# Altium project TurboCtrl.PrjPCB
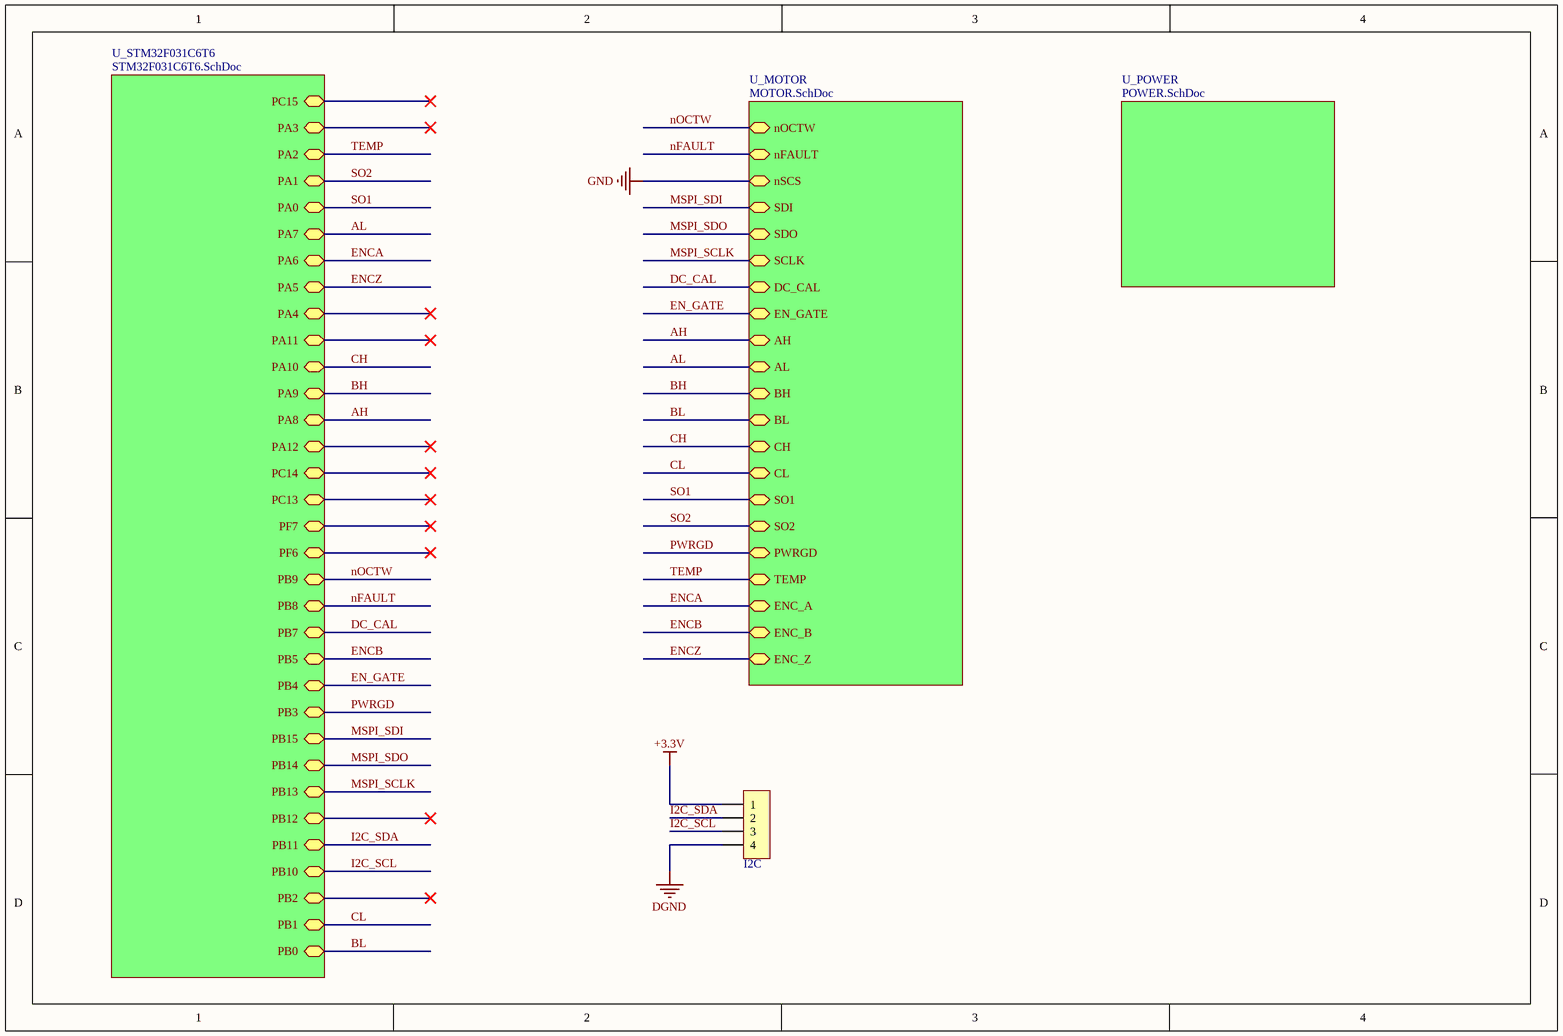
[diagram p0: MAIN.SchDoc]
4 sheets, 107 parts. Net scope: hierarchical (ports join the sheet entries above them; power ports are global).
Board file: TurboCtrl.PcbDoc
Sheets:
  MAIN.SchDoc
    U_MOTOR = MOTOR.SchDoc
    U_STM32F031C6T6 = STM32F031C6T6.SchDoc
    U_POWER = POWER.SchDoc

## Sheet MAIN.SchDoc
size A4

### Parts
I2C  HDR-1X4  [ZH1.5-WS-4P]  (value not drawn)

### Sub-sheets
U_MOTOR = MOTOR.SchDoc: nOCTW (bidir), nFAULT (bidir), nSCS (bidir), SDI (bidir), SDO (bidir), SCLK (bidir), DC_CAL (bidir), EN_GATE (bidir), AH (bidir), AL (bidir), BH (bidir), BL (bidir), CH (bidir), CL (bidir), SO1 (bidir), SO2 (bidir), PWRGD (bidir), TEMP (bidir), ENC_A (bidir), ENC_B (bidir), ENC_Z (bidir)
U_POWER = POWER.SchDoc: no entries
U_STM32F031C6T6 = STM32F031C6T6.SchDoc: PB0 (bidir), PB1 (bidir), PB2 (bidir), PB10 (bidir), PB11 (bidir), PB12 (bidir), PB13 (bidir), PB14 (bidir), PB15 (bidir), PB3 (bidir), PB4 (bidir), PB5 (bidir), PB7 (bidir), PB8 (bidir), PB9 (bidir), PF6 (bidir), PF7 (bidir), PC13 (bidir), PC14 (bidir), PA12 (bidir), PA8 (bidir), PA9 (bidir), PA10 (bidir), PA11 (bidir), PA4 (bidir), PA5 (bidir), PA6 (bidir), PA7 (bidir), PA0 (bidir), PA1 (bidir), PA2 (bidir), PA3 (bidir), PC15 (bidir)

### Nets
+3.3V: I2C.1
DGND: I2C.4
AH: sheet U_MOTOR/AH, sheet U_STM32F031C6T6/PA8
AL: sheet U_MOTOR/AL, sheet U_STM32F031C6T6/PA7
BH: sheet U_MOTOR/BH, sheet U_STM32F031C6T6/PA9
BL: sheet U_MOTOR/BL, sheet U_STM32F031C6T6/PB0
CH: sheet U_MOTOR/CH, sheet U_STM32F031C6T6/PA10
CL: sheet U_MOTOR/CL, sheet U_STM32F031C6T6/PB1
DC_CAL: sheet U_MOTOR/DC_CAL, sheet U_STM32F031C6T6/PB7
EN_GATE: sheet U_MOTOR/EN_GATE, sheet U_STM32F031C6T6/PB4
ENCA: sheet U_MOTOR/ENC_A, sheet U_STM32F031C6T6/PA6
ENCB: sheet U_MOTOR/ENC_B, sheet U_STM32F031C6T6/PB5
ENCZ: sheet U_MOTOR/ENC_Z, sheet U_STM32F031C6T6/PA5
I2C_SCL: I2C.3 ; sheet U_STM32F031C6T6/PB10
I2C_SDA: I2C.2 ; sheet U_STM32F031C6T6/PB11
MSPI_SCLK: sheet U_MOTOR/SCLK, sheet U_STM32F031C6T6/PB13
MSPI_SDI: sheet U_MOTOR/SDI, sheet U_STM32F031C6T6/PB15
MSPI_SDO: sheet U_MOTOR/SDO, sheet U_STM32F031C6T6/PB14
nFAULT: sheet U_MOTOR/nFAULT, sheet U_STM32F031C6T6/PB8
nOCTW: sheet U_MOTOR/nOCTW, sheet U_STM32F031C6T6/PB9
PWRGD: sheet U_MOTOR/PWRGD, sheet U_STM32F031C6T6/PB3
SO1: sheet U_MOTOR/SO1, sheet U_STM32F031C6T6/PA0
SO2: sheet U_MOTOR/SO2, sheet U_STM32F031C6T6/PA1
TEMP: sheet U_MOTOR/TEMP, sheet U_STM32F031C6T6/PA2

### Library data of the parts
I2C = Header 4: 4P接插件; 联系卖家，免费查找封装: 唯一出售店铺网址https://shop463601444.taobao.com; BOM名称: 4P接插件

## Sheet MOTOR.SchDoc
size A3
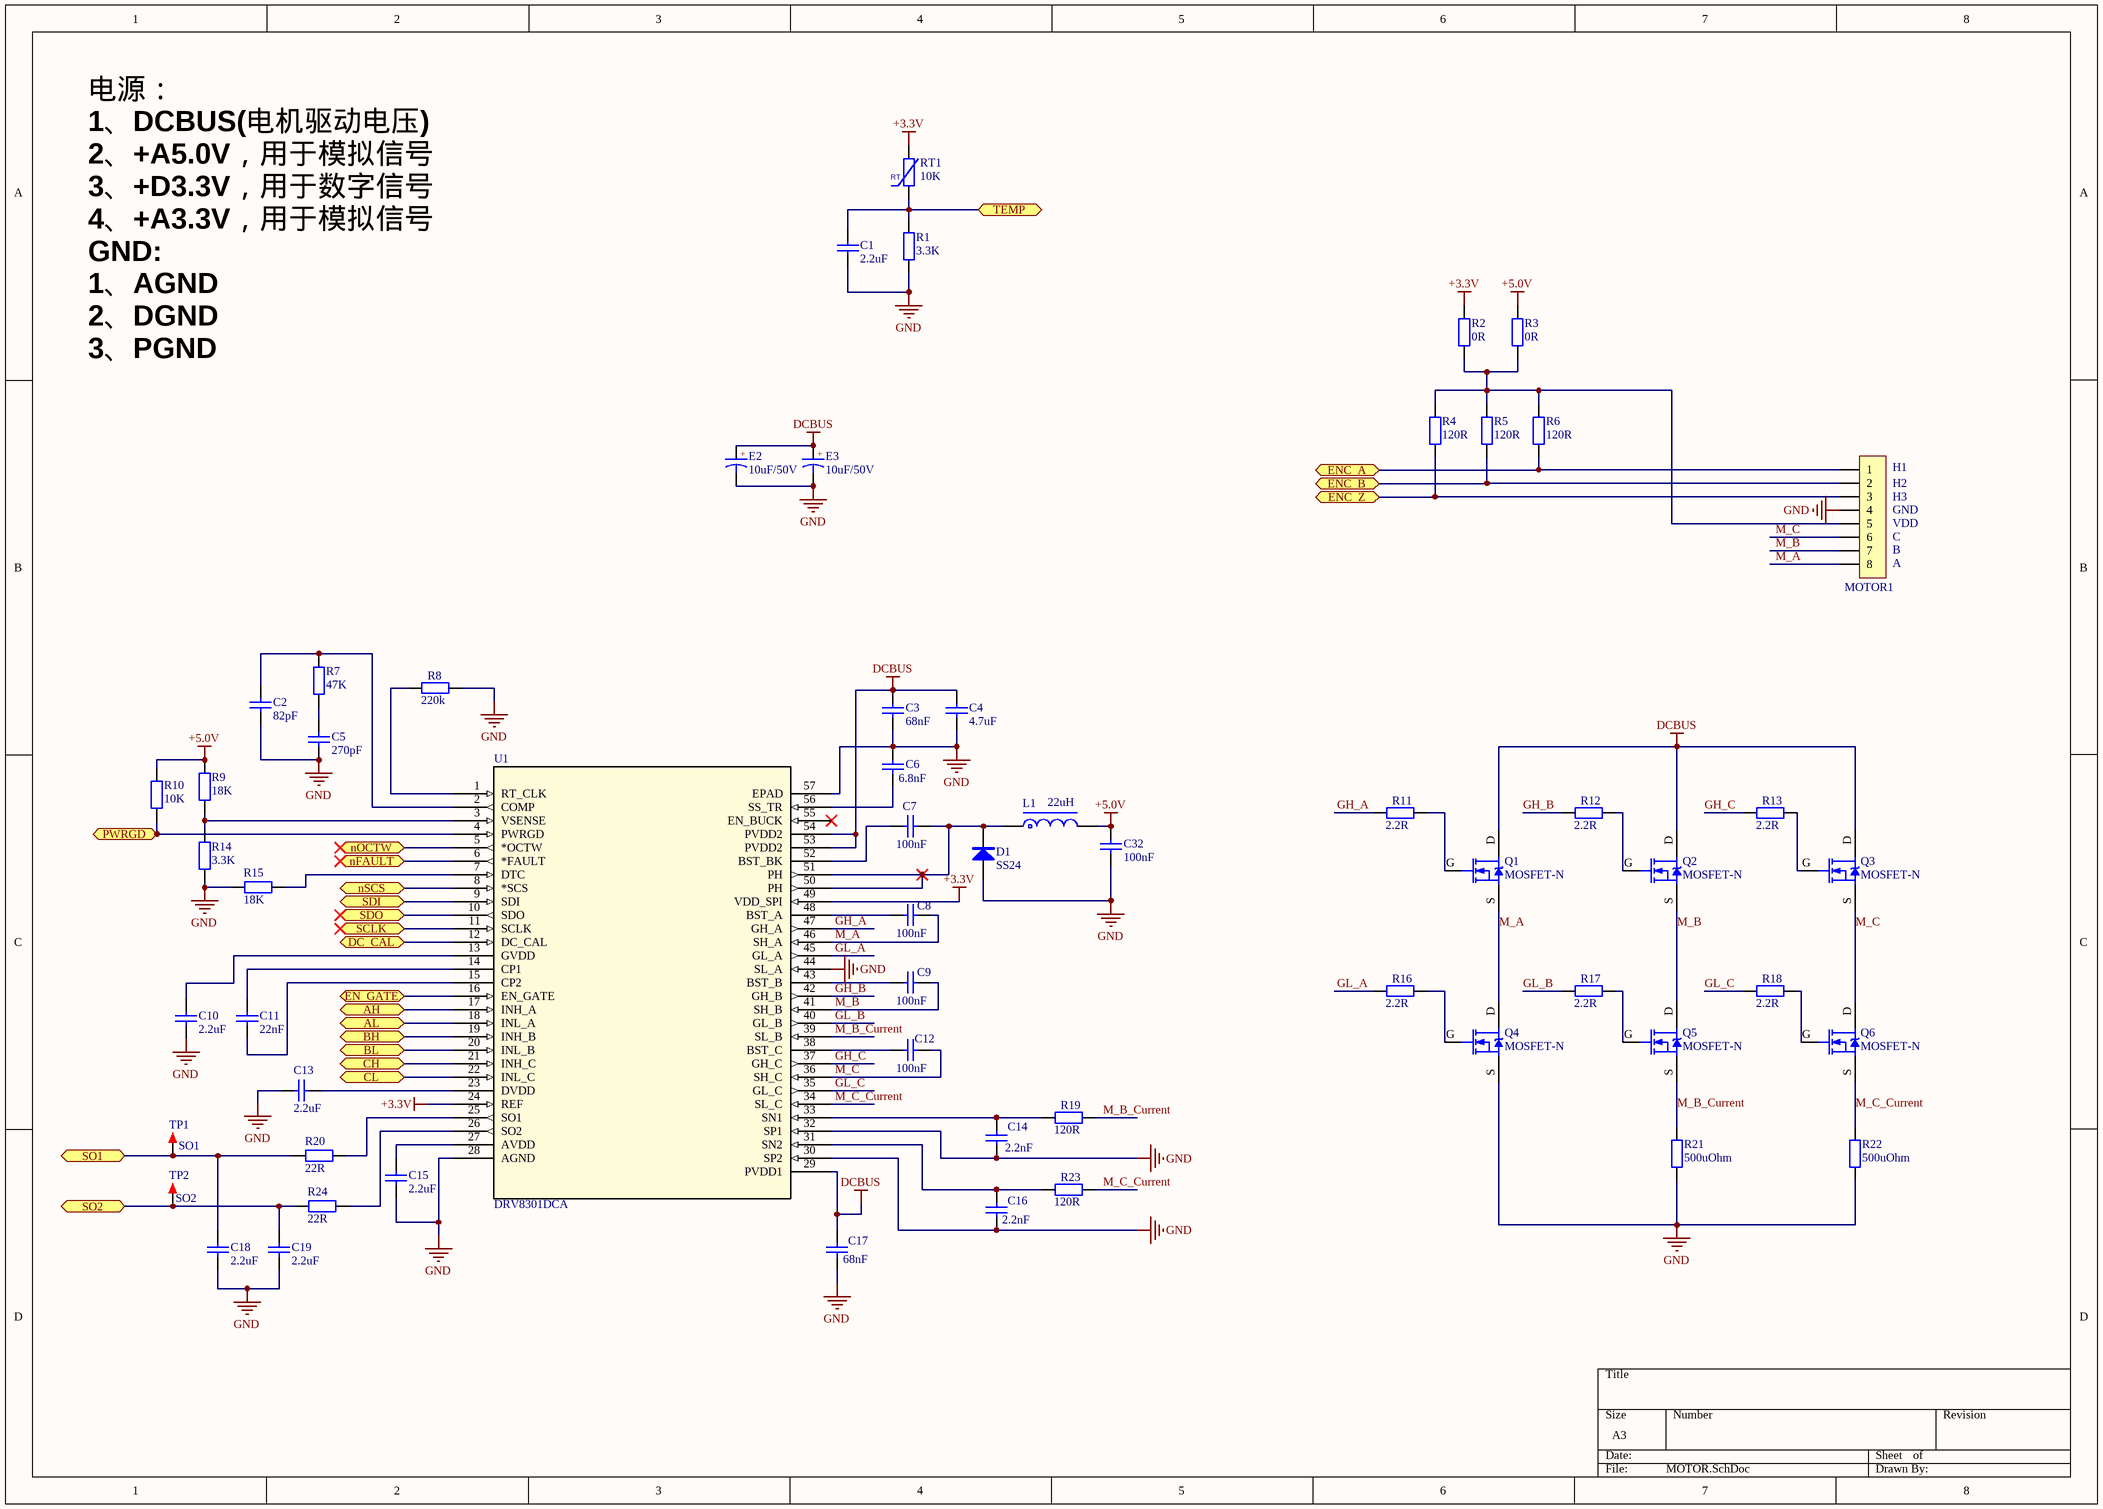
[diagram p1: MOTOR.SchDoc]

### Parts
(Parts that share a designator on the sheet are numbered #1, #2 ... from top to bottom, then left to right.)
C1  2.2uF  [C0603_M]
C2  82pF  [C0603_M]
C3  68nF  [C0603_M]
C4  4.7uF  [C0603_M]
C5  270pF  [C0603_M]
C6  6.8nF  [C0603_M]
C7  100nF  [C0603_M]
C8  100nF  [C0603_M]
C9  100nF  [C0603_M]
C10  2.2uF  [C0603_M]
C11  22nF  [C0603_M]
C12  100nF  [C0603_M]
C13  2.2uF  [C0603_M]
C14  2.2nF  [C0603_M]
C15  2.2uF  [C0603_M]
C16  2.2nF  [C0603_M]
C17  68nF  [C0603_M]
C18  2.2uF  [C0603_M]
C19  2.2uF  [C0603_M]
C32#1  100nF  [C0805_M]
D1  SS24  [SMA]
E2  10uF/50V  [CE C(5*5.4)]
E3  10uF/50V  [CE C(5*5.4)]
L1  22uH  [L-SMD-0420]
MOTOR1  HDR-1X8  [PH2.0-W-8P]  (value not drawn)
Q1  MOSFET-N  [DFN5_5X6_ONS]
Q2  MOSFET-N  [DFN5_5X6_ONS]
Q3  MOSFET-N  [DFN5_5X6_ONS]
Q4  MOSFET-N  [DFN5_5X6_ONS]
Q5  MOSFET-N  [DFN5_5X6_ONS]
Q6  MOSFET-N  [DFN5_5X6_ONS]
R1  3.3K  [R0603_M]
R2  0R  [R0603_M]
R3  0R  [R0603_M]
R4  120R  [R0603_M]
R5  120R  [R0603_M]
R6  120R  [R0603_M]
R7  47K  [R0603_M]
R8  220k  [R0603_M]
R9  18K  [R0603_M]
R10  10K  [R0603_M]
R11  2.2R  [R0603_M]
R12  2.2R  [R0603_M]
R13  2.2R  [R0603_M]
R14  3.3K  [R0603_M]
R15  18K  [R0603_M]
R16  2.2R  [R0603_M]
R17  2.2R  [R0603_M]
R18  2.2R  [R0603_M]
R19  120R  [R0603_M]
R20  22R  [R0603_M]
R21  500uOhm  [R2512_M]
R22  500uOhm  [R2512_M]
R23  120R  [R0603_M]
R24  22R  [R0603_M]
RT1  10K  [R0805-HP_L]
TP1  SO1  [TEST 0.8]
TP2  SO2  [TEST 0.8]
U1  DRV8301DCA  [DRV8301DCA]

### Ports
AH (bidir), AL (bidir), BH (bidir), BL (bidir), CH (bidir), CL (bidir), DC_CAL (bidir), EN_GATE (bidir), ENC_A (bidir), ENC_B (bidir), ENC_Z (bidir), nFAULT (bidir), nOCTW (bidir), nSCS (bidir), PWRGD (bidir), SCLK (bidir), SDI (bidir), SDO (bidir), SO1 (bidir), SO2 (bidir), TEMP (bidir)

### Nets
+3.3V: R2.1 RT1.2 U1.24(REF) U1.49(VDD_SPI)
+5.0V: C32#1.1 L1.2 R3.1 R9.1 R10.1
DCBUS: C3.1 C4.1 C17.2 E2.1 E3.1 Q1.D Q2.D Q3.D U1.29(PVDD1) U1.53(PVDD2) U1.54(PVDD2)
GND: C1.2 C2.2 C3.2 C4.2 C5.2 C6.1 C10.2 C13.1 C14.1 C15.2 C16.1 C17.1 C18.2 C19.2 C32#1.2 D1.1(A) E2.2 E3.2 MOTOR1.4 Q4.S R1.2 R8.1 R14.2 R15.1 R21.1 R22.1 U1.8(*SCS) U1.28(AGND) U1.30(SP2) U1.32(SP1) U1.44(SL_A) U1.57(EPAD) ; port nSCS
AH: U1.17(INH_A) ; port AH
AL: U1.18(INL_A) ; port AL
BH: U1.19(INH_B) ; port BH
BL: U1.20(INL_B) ; port BL
CH: U1.21(INH_C) ; port CH
CL: U1.22(INL_C) ; port CL
DC_CAL: U1.12(DC_CAL) ; port DC_CAL
EN_GATE: U1.16(EN_GATE) ; port EN_GATE
ENCA: MOTOR1.1 R6.2 ; port ENC_A
ENCB: MOTOR1.2 R5.2 ; port ENC_B
ENCZ: MOTOR1.3 R4.2 ; port ENC_Z
GH_A: R11.2 U1.47(GH_A)
GH_B: R12.2 U1.42(GH_B)
GH_C: R13.2 U1.37(GH_C)
GL_A: R16.2 U1.45(GL_A)
GL_B: R17.2 U1.40(GL_B)
GL_C: R18.2 U1.35(GL_C)
M_A: C8.1 MOTOR1.8 Q1.S Q4.D U1.46(SH_A)
M_B: C9.1 MOTOR1.7 Q2.S Q5.D U1.41(SH_B)
M_B_Current: Q5.S R19.1 R21.2 U1.39(SL_B)
M_C: C12.1 MOTOR1.6 Q3.S Q6.D U1.36(SH_C)
M_C_Current: Q6.S R22.2 R23.1 U1.34(SL_C)
MSPI_SCLK: U1.11(SCLK) ; port SCLK
MSPI_SDI: U1.9(SDI) ; port SDI
MSPI_SDO: U1.10(SDO) ; port SDO
nFAULT: U1.6(*FAULT) ; port nFAULT
nOCTW: U1.5(*OCTW) ; port nOCTW
PWRGD: R10.2 U1.4(PWRGD) ; port PWRGD
SO1: C18.1 R20.1 TP1.1 ; port SO1
SO2: C19.1 R24.1 TP2.1 ; port SO2
TEMP: C1.1 R1.1 RT1.1 ; port TEMP
NetC2_1: C2.1 R7.1 U1.2(COMP)
NetC5_1: C5.1 R7.2
NetC6_2: C6.2 U1.56(SS_TR)
NetC7_1: C7.1 D1.2(K) L1.1 U1.50(PH) U1.51(PH)
NetC7_2: C7.2 U1.52(BST_BK)
NetC8_2: C8.2 U1.48(BST_A)
NetC9_2: C9.2 U1.43(BST_B)
NetC10_1: C10.1 U1.13(GVDD)
NetC11_1: C11.1 U1.14(CP1)
NetC11_2: C11.2 U1.15(CP2)
NetC12_2: C12.2 U1.38(BST_C)
NetC13_2: C13.2 U1.23(DVDD)
NetC14_2: C14.2 R19.2 U1.33(SN1)
NetC15_1: C15.1 U1.27(AVDD)
NetC16_2: C16.2 R23.2 U1.31(SN2)
NetMOTOR1_5: MOTOR1.5 R2.2 R3.2 R4.1 R5.1 R6.1
NetQ1_G: Q1.G R11.1
NetQ2_G: Q2.G R12.1
NetQ3_G: Q3.G R13.1
NetQ4_G: Q4.G R16.1
NetQ5_G: Q5.G R17.1
NetQ6_G: Q6.G R18.1
NetR8_2: R8.2 U1.1(RT_CLK)
NetR9_2: R9.2 R14.1 U1.3(VSENSE)
NetR15_2: R15.2 U1.7(DTC)
NetR20_2: R20.2 U1.25(SO1)
NetR24_2: R24.2 U1.26(SO2)

Not connected (* = marked no-connect by the designer): U1 55(EN_BUCK)*

### Notes on the sheet
- 电源：
  1、DCBUS(电机驱动电压)
  2、+A5.0V，用于模拟信号
  3、+D3.3V，用于数字信号
  4、+A3.3V，用于模拟信号
  GND:
  1、AGND
  2、DGND
  3、PGND
- (near MOTOR1) GND
- (near MOTOR1) H3
- (near MOTOR1) H2
- (near MOTOR1) H1
- (near MOTOR1) A
- (near MOTOR1) B
- (near MOTOR1) C
- (near MOTOR1) VDD
- (in symbol CE_SMD) +

### Library data of the parts
C1-C19 C32#1 = C: 贴片电容/MLCC电容; BOM名称: 无极性贴片电容; 联系卖家，免费查找封装: 唯一出售店铺网址https://shop463601444.taobao.com
D1 = 1N4007: 整流二极管; 以赠品形式获赠本封装库的买家，还可联系卖家免费指导AD软件使用: 封装库来自淘宝卖家ID：黄晶宝石; 联系卖家 免费查找封装: 唯一出售店铺网址https://shop463601444.taobao.com; BOM名称: 整流二极管
E2 E3 = CE_SMD: 贴片电解电容; 联系卖家，免费查找封装: 唯一出售店铺网址https://shop463601444.taobao.com; BOM名称: 贴片电解电容
L1 = L-Molding Choke: 一体成型电感; 联系卖家，免费查找封装: 唯一出售店铺网址https://shop463601444.taobao.com; BOM名称: 一体成型电感
MOTOR1 = Header 8: 8P接插件; 以赠品形式获赠本封装库的买家，还可联系卖家免费指导AD软件使用: 联系卖家 免费技术支持; 联系卖家，免费查找封装: 唯一出售店铺网址https://shop463601444.taobao.com
Q1-Q6 = MOSFET-N: N-Channel MOSFET; PackageDocument: 1995/1996; Published: 8-Jun-2000; LatestRevisionDate: 17-Jul-2002; LatestRevisionNote: Re-released for DXP Platform.; PackageReference: E3; Publisher: Altium Limited
R1-R24 = R: 贴片电阻; 联系卖家，免费查找封装: 唯一出售店铺网址https://shop463601444.taobao.com; BOM名称: 贴片电阻
RT1 = RT: 热敏电阻; BOM名称: 压敏电阻; 联系卖家，免费查找封装: 唯一出售店铺网址https://shop463601444.taobao.com
TP1 TP2 = TEST: 测试点; 联系卖家，免费查找封装: 唯一出售店铺网址https://shop463601444.taobao.com; 封装库来自淘宝卖家ID:黄晶宝石: 其他店铺购入均为盗版假冒封装库，请立即申请退款，本店现金奖励20~200元; BOM名称: 测试点
U1 = DRV8301DCA: No Description Available; Mfr_Name: Texas Instruments; Copyright: Copyright (C) 2021 Ultra Librarian. All rights reserved.; Manufacturer_Part_Number: DRV8301DCA; RefDes: RefDes; Type: DEV

## Sheet STM32F031C6T6.SchDoc
size A4
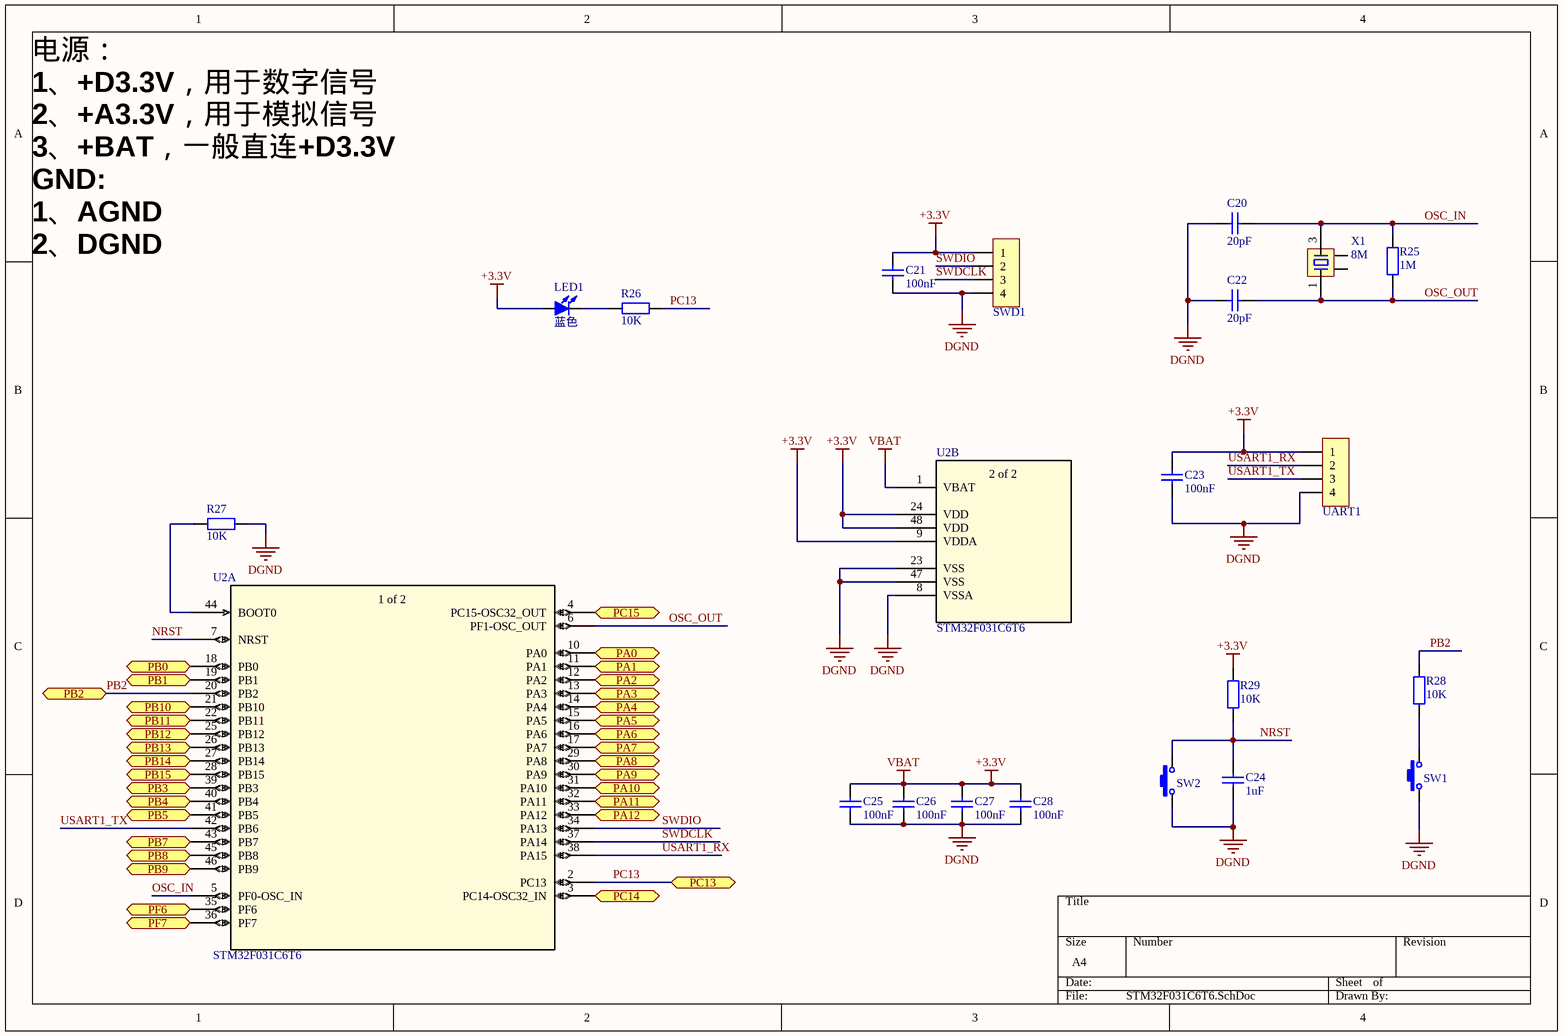
[diagram p2: STM32F031C6T6.SchDoc]

### Parts
(Parts that share a designator on the sheet are numbered #1, #2 ... from top to bottom, then left to right.)
C20  20pF  [C0603_M]
C21  100nF  [C0603_M]
C22  20pF  [C0603_M]
C23  100nF  [C0603_M]
C24  1uF  [C0603_M]
C25  100nF  [C0603_M]
C26  100nF  [C0603_M]
C27  100nF  [C0603_M]
C28  100nF  [C0603_M]
LED1#1  蓝色  [LED0603_B]
R25  1M  [R0603_M]
R26#1  10K  [R0603_M]
R27  10K  [R0603_M]
R28  10K  [R0603_M]
R29  10K  [R0603_M]
SW1  3x6x5  [SW 3*6*4.3-S-W]  (value not drawn)
SW2  3x6x5  [SW 3*6*4.3-S-W]  (value not drawn)
SWD1  HDR-1X4  [ZH1.5-WS-4P]  (value not drawn)
U2  STM32F031C6T6  [LQFP48-7x7mm]  (parts A,B of 2)
UART1  HDR-1X4  [ZH1.5-WS-4P]  (value not drawn)
X1  8M  [XTAL-3225-4P]

### Ports
PA0 (bidir), PA1 (bidir), PA2 (bidir), PA3 (bidir), PA4 (bidir), PA5 (bidir), PA6 (bidir), PA7 (bidir), PA8 (bidir), PA9 (bidir), PA10 (bidir), PA11 (bidir), PA12 (bidir), PB0 (bidir), PB1 (bidir), PB2 (bidir), PB3 (bidir), PB4 (bidir), PB5 (bidir), PB7 (bidir), PB8 (bidir), PB9 (bidir), PB10 (bidir), PB11 (bidir), PB12 (bidir), PB13 (bidir), PB14 (bidir), PB15 (bidir), PC13 (bidir), PC14 (bidir), PC15 (bidir), PF6 (bidir), PF7 (bidir)

### Nets
+3.3V: C21.2 C23.2 C25.2 C26.2 C27.2 C28.2 LED1#1.1(A) R29.2 SWD1.1 U2.1(VBAT) U2.9(VDDA) U2.24(VDD) U2.48(VDD) UART1.1  [also labelled VBAT]
DGND: C20.2 C21.1 C22.2 C23.1 C24.1 C25.1 C26.1 C27.1 C28.1 R27.1 SW1.1 SW2.1 SWD1.4 U2.8(VSSA) U2.23(VSS) U2.47(VSS) UART1.4
AH: U2.29(PA8) ; port PA8
AL: U2.17(PA7) ; port PA7
BH: U2.30(PA9) ; port PA9
BL: U2.18(PB0) ; port PB0
CH: U2.31(PA10) ; port PA10
CL: U2.19(PB1) ; port PB1
DC_CAL: U2.43(PB7) ; port PB7
EN_GATE: U2.40(PB4) ; port PB4
ENCA: U2.16(PA6) ; port PA6
ENCB: U2.41(PB5) ; port PB5
ENCZ: U2.15(PA5) ; port PA5
I2C_SCL: U2.21(PB10) ; port PB10
I2C_SDA: U2.22(PB11) ; port PB11
MSPI_SCLK: U2.26(PB13) ; port PB13
MSPI_SDI: U2.28(PB15) ; port PB15
MSPI_SDO: U2.27(PB14) ; port PB14
nFAULT: U2.45(PB8) ; port PB8
nOCTW: U2.46(PB9) ; port PB9
NRST: C24.2 R29.1 SW2.2 U2.7(NRST)
OSC_IN: C20.1 R25.1 U2.5(PF0-OSC_IN) X1.3
OSC_OUT: C22.1 R25.2 U2.6(PF1-OSC_OUT) X1.1
PB2: R28.2 U2.20(PB2) ; port PB2
PC13: R26#1.1 U2.2(PC13) ; port PC13
PWRGD: U2.39(PB3) ; port PB3
SO1: U2.10(PA0) ; port PA0
SO2: U2.11(PA1) ; port PA1
SWDCLK: SWD1.3 U2.37(PA14)
SWDIO: SWD1.2 U2.34(PA13)
TEMP: U2.12(PA2) ; port PA2
USART1_RX: U2.38(PA15) UART1.2
USART1_TX: U2.42(PB6) UART1.3
NetLED1#1_2: LED1#1.2(K) R26#1.2
NetR27_2: R27.2 U2.44(BOOT0)
NetR28_1: R28.1 SW1.2
NetU2_3: U2.3(PC14-OSC32_IN) ; port PC14
NetU2_4: U2.4(PC15-OSC32_OUT) ; port PC15
NetU2_13: U2.13(PA3) ; port PA3
NetU2_14: U2.14(PA4) ; port PA4
NetU2_25: U2.25(PB12) ; port PB12
NetU2_32: U2.32(PA11) ; port PA11
NetU2_33: U2.33(PA12) ; port PA12
NetU2_35: U2.35(PF6) ; port PF6
NetU2_36: U2.36(PF7) ; port PF7

Not connected (* = marked no-connect by the designer): X1 2 4

### Notes on the sheet
- 电源：
  1、+D3.3V，用于数字信号
  2、+A3.3V，用于模拟信号
  3、+BAT，一般直连+D3.3V
  GND:
  1、AGND
  2、DGND
- (in symbol STM32F031C6T6, part A) 1 of 2
- (in symbol STM32F031C6T6, part B) 2 of 2

### Library data of the parts
C20-C28 = C: as C1 on sheet MOTOR
LED1#1 = LED-SMD: 贴片LED; 封装库来自淘宝卖家ID：黄晶宝石: 其他店铺购入均为盗版封装库，请立即申请退款，本店现金奖励20~200元; BOM名称: 贴片LED
R25 R26#1 R27-R29 = R: as R1 on sheet MOTOR; BOM名称: 贴片电阻
SW1 SW2 = SW 3x6: 3x6轻触开关; 联系卖家，免费查找封装: 唯一出售店铺网址https://shop463601444.taobao.com; 封装库来自淘宝卖家ID:黄晶宝石: 其他店铺购入均为盗版假冒封装库，请立即申请退款，本店现金奖励20~200元; BOM名称: 3x6轻触开关
SWD1 UART1 = Header 4: as I2C on sheet MAIN; BOM名称: 4P接插件
U2 = STM32F031C6T6: No Description Available; Mfr_Name: STMicroelectronics; Copyright: Copyright (C) 2021 Ultra Librarian. All rights reserved.; Manufacturer_Part_Number: STM32F031C6T6; RefDes: RefDes; Type: DEV
X1 = XTAL-4P: 4脚无源晶振(谐振器）; 联系卖家，免费查找封装: 唯一出售店铺网址https://shop463601444.taobao.com; BOM名称: 4脚无源晶振(谐振器）

## Sheet POWER.SchDoc
size A4
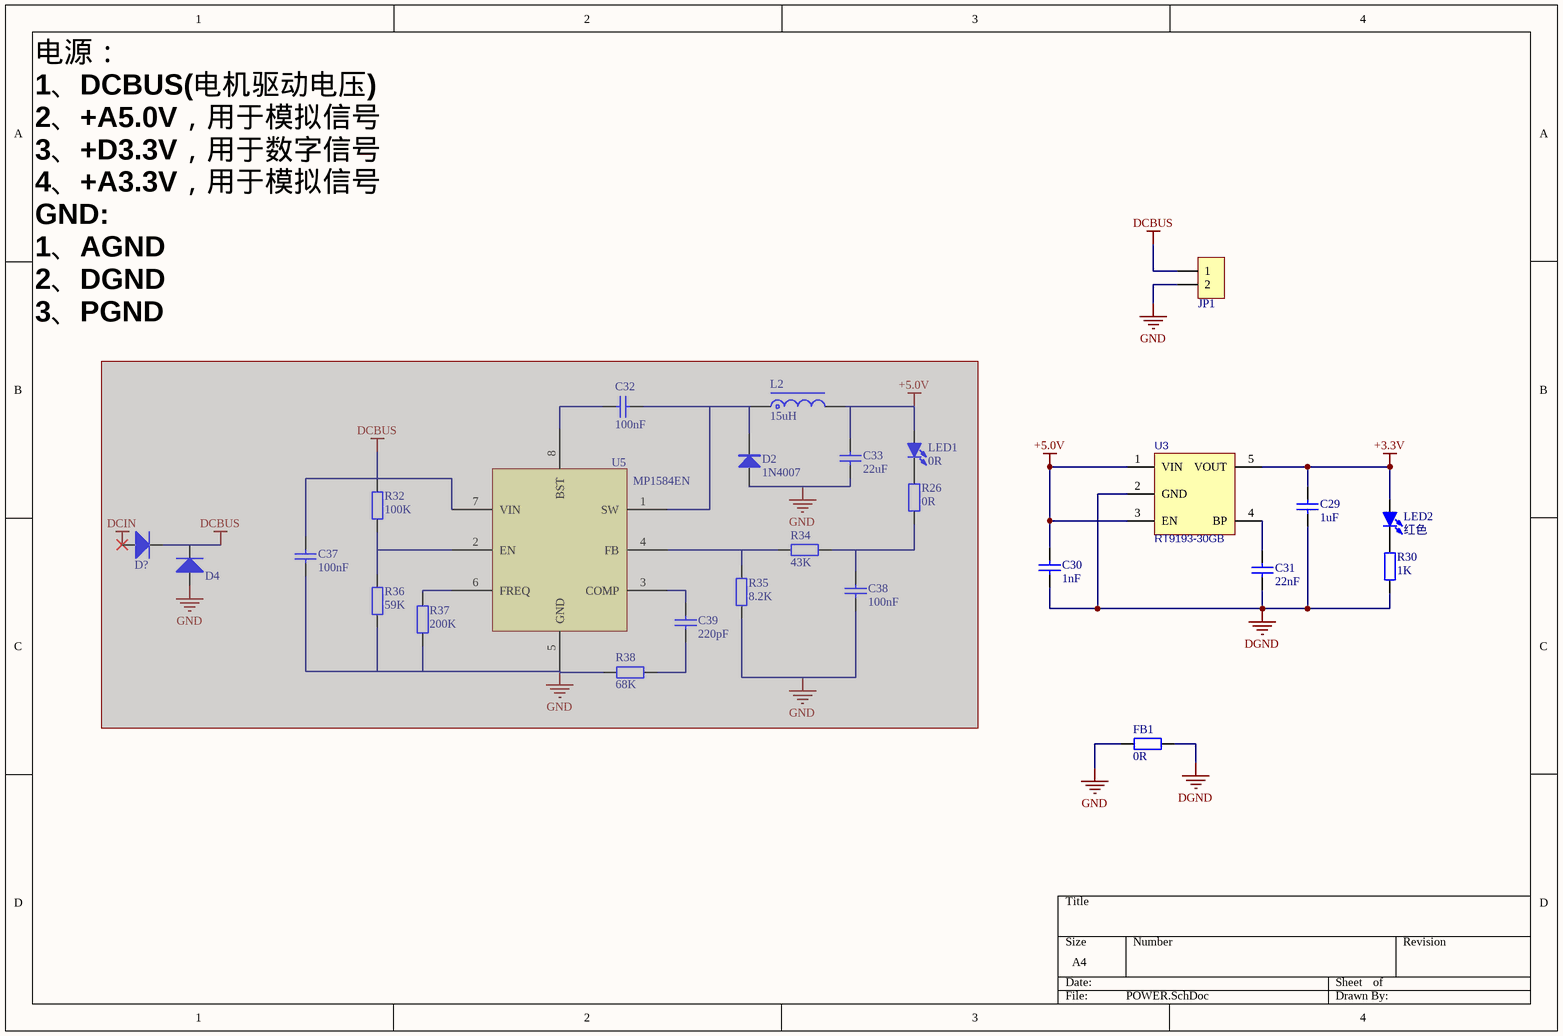
[diagram p3: POWER.SchDoc]

### Parts
(Parts that share a designator on the sheet are numbered #1, #2 ... from top to bottom, then left to right.)
C29  1uF  [C0603_M]
C30  1nF  [C0603_M]
C31  22nF  [C0603_M]
C32#2  100nF  [C0603_M]  (masked out: inside a compile mask, not in the netlist)
C33  22uF  [C0805_L]  (masked out: inside a compile mask, not in the netlist)
C37  100nF  [C0603_M]  (masked out: inside a compile mask, not in the netlist)
C38  100nF  [C0603_M]  (masked out: inside a compile mask, not in the netlist)
C39  220pF  [C0603_M]  (masked out: inside a compile mask, not in the netlist)
D2  1N4007  [SOD-123]  (masked out: inside a compile mask, not in the netlist)
D4  TVS  [SOD-123]  (value not drawn)  (masked out: inside a compile mask, not in the netlist)
D?  TVS  [SMA]  (value not drawn)  (masked out: inside a compile mask, not in the netlist)
FB1  0R  [R0603_L]
JP1  HDR-1X2  [PH2.0-W-2P]  (value not drawn)
L2  15uH  [L-SMD-0420]  (masked out: inside a compile mask, not in the netlist)
LED1#2  0R  [LED0603_B]  (masked out: inside a compile mask, not in the netlist)
LED2  红色  [LED0603_R]
R26#2  0R  [R0603_M]  (masked out: inside a compile mask, not in the netlist)
R30  1K  [R0603_M]
R32  100K  [R0603_M]  (masked out: inside a compile mask, not in the netlist)
R34  43K  [R0603_M]  (masked out: inside a compile mask, not in the netlist)
R35  8.2K  [R0603_M]  (masked out: inside a compile mask, not in the netlist)
R36  59K  [R0603_M]  (masked out: inside a compile mask, not in the netlist)
R37  200K  [R0603_M]  (masked out: inside a compile mask, not in the netlist)
R38  68K  [R0603_M]  (masked out: inside a compile mask, not in the netlist)
U3  RT9193-30GB  [SOT-23-5]
U5  MP1584EN  [ESOP8_N]  (masked out: inside a compile mask, not in the netlist)

### Nets
+3.3V: C29.1 LED2.1(A) U3.5(VOUT)
+5.0V: C30.1 U3.1(VIN) U3.3(EN)
DCBUS: JP1.1
DGND: C29.2 C30.2 C31.2 FB1.2 R30.2 U3.2(GND)
GND: FB1.1 JP1.2
NetC31_1: C31.1 U3.4(BP)
NetLED2_2: LED2.2(K) R30.1

### Notes on the sheet
- 电源：
  1、DCBUS(电机驱动电压)
  2、+A5.0V，用于模拟信号
  3、+D3.3V，用于数字信号
  4、+A3.3V，用于模拟信号
  GND:
  1、AGND
  2、DGND
  3、PGND

### Library data of the parts
C29-C31 C32#2 C33 C37-C39 = C: as C1 on sheet MOTOR
D2 = 1N4007: as D1 on sheet MOTOR; BOM名称: 整流二极管
D4 D? = TVS: TVS通用; 以赠品形式获赠本封装库的买家，还可联系卖家免费指导AD软件使用: 封装库来自淘宝卖家ID：黄晶宝石; 联系卖家 免费查找封装: 唯一出售店铺网址https://shop463601444.taobao.com; Code_JEDEC: DO-214-AB
FB1 R26#2 R30 R32 R34-R38 = R: as R1 on sheet MOTOR; BOM名称: 贴片电阻
JP1 = Header 2: 2P接插件; 以赠品形式获赠本封装库的买家，还可联系卖家免费指导AD软件使用: 联系卖家 免费技术支持; 联系卖家，免费查找封装: 唯一出售店铺网址https://shop463601444.taobao.com; BOM名称: 2P接插件
L2 = L-Molding Choke: as L1 on sheet MOTOR; BOM名称: 一体成型电感
LED1#2 LED2 = LED-SMD: as LED1#1 on sheet STM32F031C6T6; BOM名称: 贴片LED
U3 = RT9193-30GB: LDO 3.0V/0.3A; 芯片厂商: RICHTEK; 封装库来自淘宝卖家ID：黄晶宝石: 其他店铺购入均为盗版封装库，请立即申请退款，本店现金奖励20~200元; BOM名称: RT9193-30GB
U5 = MP1584EN: 28V/3A降压稳压器

## Nets that join several sheets
+3.3V: MAIN (I2C.1), MOTOR (R2.1 RT1.2 U1.24 U1.49), STM32F031C6T6 (14 pins), POWER (C29.1 LED2.1 U3.5)
+5.0V: MOTOR (5 pins), POWER (C30.1 U3.1 U3.3)
DCBUS: MOTOR (11 pins), POWER (JP1.1)
DGND: MAIN (I2C.4), STM32F031C6T6 (17 pins), POWER (6 pins)
GND: MOTOR (32 pins), POWER (FB1.1 JP1.2)
AH: MOTOR (U1.17), STM32F031C6T6 (U2.29)
AL: MOTOR (U1.18), STM32F031C6T6 (U2.17)
BH: MOTOR (U1.19), STM32F031C6T6 (U2.30)
BL: MOTOR (U1.20), STM32F031C6T6 (U2.18)
CH: MOTOR (U1.21), STM32F031C6T6 (U2.31)
CL: MOTOR (U1.22), STM32F031C6T6 (U2.19)
DC_CAL: MOTOR (U1.12), STM32F031C6T6 (U2.43)
EN_GATE: MOTOR (U1.16), STM32F031C6T6 (U2.40)
ENCA: MOTOR (MOTOR1.1 R6.2), STM32F031C6T6 (U2.16)
ENCB: MOTOR (MOTOR1.2 R5.2), STM32F031C6T6 (U2.41)
ENCZ: MOTOR (MOTOR1.3 R4.2), STM32F031C6T6 (U2.15)
I2C_SCL: MAIN (I2C.3), STM32F031C6T6 (U2.21)
I2C_SDA: MAIN (I2C.2), STM32F031C6T6 (U2.22)
MSPI_SCLK: MOTOR (U1.11), STM32F031C6T6 (U2.26)
MSPI_SDI: MOTOR (U1.9), STM32F031C6T6 (U2.28)
MSPI_SDO: MOTOR (U1.10), STM32F031C6T6 (U2.27)
nFAULT: MOTOR (U1.6), STM32F031C6T6 (U2.45)
nOCTW: MOTOR (U1.5), STM32F031C6T6 (U2.46)
PWRGD: MOTOR (R10.2 U1.4), STM32F031C6T6 (U2.39)
SO1: MOTOR (C18.1 R20.1 TP1.1), STM32F031C6T6 (U2.10)
SO2: MOTOR (C19.1 R24.1 TP2.1), STM32F031C6T6 (U2.11)
TEMP: MOTOR (C1.1 R1.1 RT1.1), STM32F031C6T6 (U2.12)